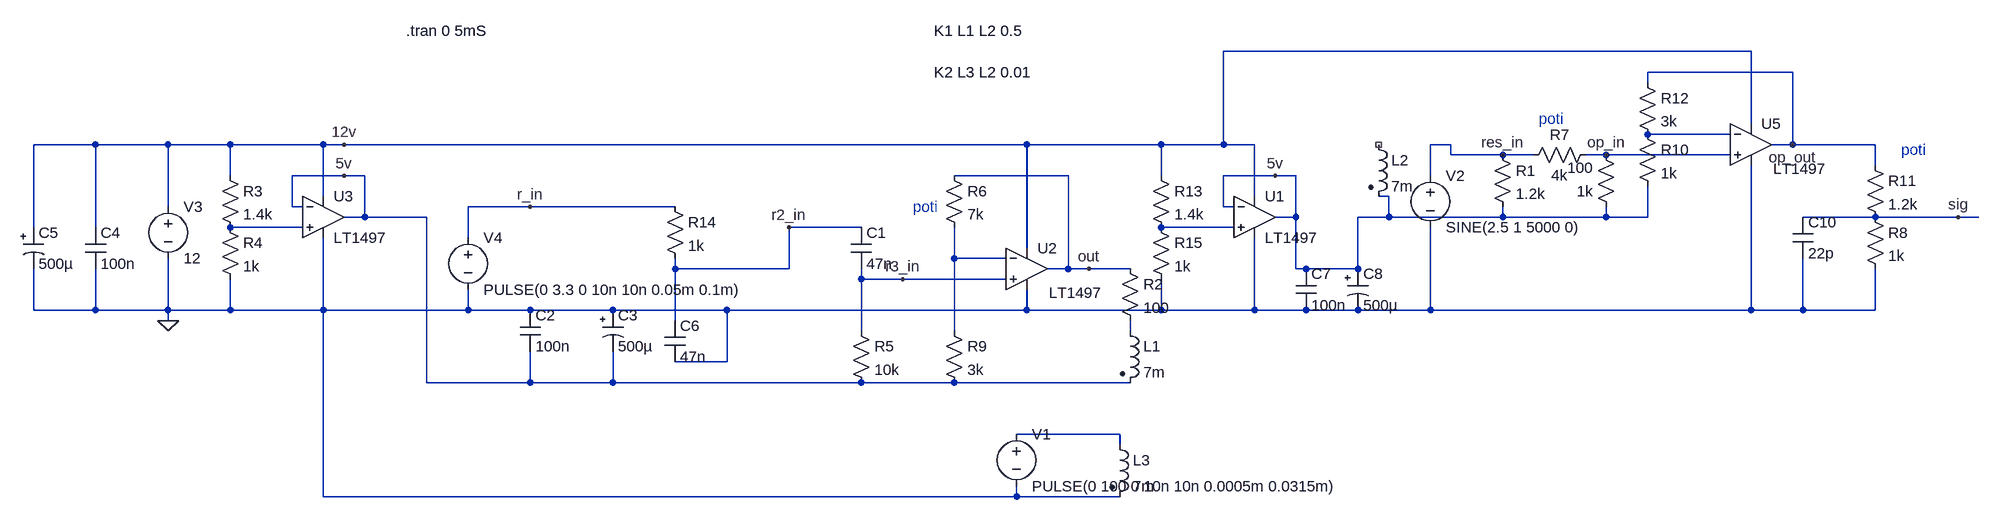
[diagram p0: schematic res2.4.asc]
res2.4.asc, the LTspice schematic file:
Version 4
SHEET 1 5176 960
WIRE 3744 -16 2928 -16
WIRE 3808 16 3584 16
WIRE 3584 32 3584 16
WIRE 3744 96 3744 -16
WIRE 3712 112 3584 112
WIRE 1184 128 1088 128
WIRE 1296 128 1184 128
WIRE 1392 128 1296 128
WIRE 1536 128 1392 128
WIRE 1568 128 1536 128
WIRE 2624 128 1568 128
WIRE 2832 128 2624 128
WIRE 2928 128 2928 -16
WIRE 2928 128 2832 128
WIRE 2976 128 2928 128
WIRE 3280 128 3248 128
WIRE 3808 128 3808 16
WIRE 3808 128 3776 128
WIRE 3936 128 3808 128
WIRE 3280 144 3280 128
WIRE 3360 144 3280 144
WIRE 3408 144 3360 144
WIRE 3520 144 3488 144
WIRE 3712 144 3520 144
WIRE 3936 160 3936 128
WIRE 1392 176 1392 128
WIRE 1568 176 1488 176
WIRE 1600 176 1568 176
WIRE 2688 176 2512 176
WIRE 2832 176 2832 128
WIRE 3008 176 2928 176
WIRE 3040 176 3008 176
WIRE 3248 176 3248 128
WIRE 1536 208 1536 128
WIRE 2976 208 2976 128
WIRE 3184 208 3168 208
WIRE 1296 224 1296 128
WIRE 1488 224 1488 176
WIRE 1504 224 1488 224
WIRE 1856 224 1760 224
WIRE 2080 224 1856 224
WIRE 2928 224 2928 176
WIRE 2944 224 2928 224
WIRE 1600 240 1600 176
WIRE 1600 240 1568 240
WIRE 1696 240 1600 240
WIRE 3040 240 3040 176
WIRE 3040 240 3008 240
WIRE 3184 240 3184 208
WIRE 3184 240 3136 240
WIRE 3360 240 3360 224
WIRE 3360 240 3184 240
WIRE 3520 240 3520 224
WIRE 3520 240 3360 240
WIRE 3584 240 3584 192
WIRE 3584 240 3520 240
WIRE 3936 240 3824 240
WIRE 4064 240 3936 240
WIRE 4096 240 4064 240
WIRE 1088 256 1088 128
WIRE 1184 256 1184 128
WIRE 1504 256 1392 256
WIRE 2368 256 2256 256
WIRE 2944 256 2832 256
WIRE 1760 272 1760 224
WIRE 2624 288 2624 128
WIRE 2512 304 2512 256
WIRE 2592 304 2512 304
WIRE 2080 320 2080 304
WIRE 2256 320 2256 256
WIRE 2256 320 2080 320
WIRE 2688 320 2688 176
WIRE 2688 320 2656 320
WIRE 2720 320 2688 320
WIRE 2784 320 2720 320
WIRE 3040 320 3040 240
WIRE 3056 320 3040 320
WIRE 3136 320 3136 240
WIRE 3136 320 3056 320
WIRE 2368 336 2368 320
WIRE 2432 336 2368 336
WIRE 2592 336 2432 336
WIRE 1088 384 1088 320
WIRE 1184 384 1184 320
WIRE 1184 384 1088 384
WIRE 1296 384 1296 304
WIRE 1296 384 1184 384
WIRE 1392 384 1392 336
WIRE 1392 384 1296 384
WIRE 1536 384 1536 272
WIRE 1536 384 1392 384
WIRE 1760 384 1760 352
WIRE 1760 384 1536 384
WIRE 1856 384 1760 384
WIRE 1984 384 1856 384
WIRE 2160 384 1984 384
WIRE 2624 384 2624 352
WIRE 2624 384 2160 384
WIRE 2832 384 2832 336
WIRE 2832 384 2624 384
WIRE 2976 384 2976 272
WIRE 2976 384 2832 384
WIRE 3056 384 2976 384
WIRE 3136 384 3056 384
WIRE 3248 384 3248 256
WIRE 3248 384 3136 384
WIRE 3744 384 3744 160
WIRE 3744 384 3248 384
WIRE 3824 384 3824 304
WIRE 3824 384 3744 384
WIRE 3936 384 3936 320
WIRE 3936 384 3824 384
WIRE 1296 400 1296 384
WIRE 2080 400 2080 320
WIRE 2368 416 2368 336
WIRE 2512 416 2512 304
WIRE 2784 416 2784 400
WIRE 2160 464 2160 384
WIRE 2160 464 2080 464
WIRE 1696 496 1696 240
WIRE 1856 496 1856 448
WIRE 1856 496 1696 496
WIRE 1984 496 1984 448
WIRE 1984 496 1856 496
WIRE 2368 496 1984 496
WIRE 2512 496 2368 496
WIRE 2784 496 2512 496
WIRE 2768 576 2608 576
WIRE 2768 592 2768 576
WIRE 1536 672 1536 384
WIRE 2608 672 2608 656
WIRE 2608 672 1536 672
WIRE 2768 672 2608 672
FLAG 1296 400 0
FLAG 1568 176 5v
FLAG 2720 320 out
FLAG 1856 224 r_in
FLAG 2256 256 r2_in
FLAG 2432 336 r3_in
FLAG 1568 128 12v
FLAG 3008 176 5v
FLAG 4064 240 sig
FLAG 3360 144 res_in
FLAG 3520 144 op_in
FLAG 3808 128 op_out
SYMBOL voltage 1296 208 R0
SYMATTR InstName V3
SYMATTR Value 12
SYMATTR SpiceLine Rser=1
SYMBOL res 1376 160 R0
SYMATTR InstName R3
SYMATTR Value 1.4k
SYMBOL res 1376 240 R0
SYMATTR InstName R4
SYMATTR Value 1k
SYMBOL ind2 2768 400 R0
SYMATTR InstName L1
SYMATTR Value 7m
SYMATTR Type ind
SYMATTR SpiceLine Rser=30
SYMBOL Opamps/LT1497 2624 256 R0
WINDOW 3 34 101 Left 2
SYMATTR InstName U2
SYMBOL ind2 3152 112 R0
SYMATTR InstName L2
SYMATTR Value 7m
SYMATTR SpiceLine Rser=70
SYMBOL res 2352 400 R0
SYMATTR InstName R5
SYMATTR Value 10k
SYMBOL cap 2352 256 R0
SYMATTR InstName C1
SYMATTR Value 47n
SYMBOL res 2496 160 R0
SYMATTR InstName R6
SYMATTR Value 7k
SYMBOL res 2496 400 R0
SYMATTR InstName R9
SYMATTR Value 3k
SYMBOL Opamps/LT1497 1536 176 R0
SYMATTR InstName U3
SYMBOL voltage 1760 256 R0
SYMATTR InstName V4
SYMATTR Value PULSE(0 3.3 0 10n 10n 0.05m 0.1m)
SYMATTR SpiceLine Rser=1
SYMBOL cap 2064 400 R0
SYMATTR InstName C6
SYMATTR Value 47n
SYMBOL res 2064 208 R0
SYMATTR InstName R14
SYMATTR Value 1k
SYMBOL cap 1840 384 R0
SYMATTR InstName C2
SYMATTR Value 100n
SYMBOL polcap 1968 384 R0
SYMATTR InstName C3
SYMATTR Value 500µ
SYMBOL cap 1168 256 R0
SYMATTR InstName C4
SYMATTR Value 100n
SYMBOL polcap 1072 256 R0
SYMATTR InstName C5
SYMATTR Value 500µ
SYMBOL ind2 2752 576 R0
SYMATTR InstName L3
SYMATTR Value 7m
SYMATTR Type ind
SYMATTR SpiceLine Rser=30
SYMBOL voltage 2608 560 R0
SYMATTR InstName V1
SYMATTR Value PULSE(0 100 0 10n 10n 0.0005m 0.0315m)
SYMATTR SpiceLine Rser=1
SYMBOL Opamps/LT1497 3744 64 R0
WINDOW 3 34 101 Left 2
SYMATTR InstName U5
SYMBOL res 3568 96 R0
SYMATTR InstName R10
SYMATTR Value 1k
SYMBOL res 3568 16 R0
SYMATTR InstName R12
SYMATTR Value 3k
SYMBOL res 2816 160 R0
SYMATTR InstName R13
SYMATTR Value 1.4k
SYMBOL res 2816 240 R0
SYMATTR InstName R15
SYMATTR Value 1k
SYMBOL Opamps/LT1497 2976 176 R0
SYMATTR InstName U1
SYMBOL cap 3040 320 R0
SYMATTR InstName C7
SYMATTR Value 100n
SYMBOL polcap 3120 320 R0
SYMATTR InstName C8
SYMATTR Value 500µ
SYMBOL res 3920 224 R0
SYMATTR InstName R8
SYMATTR Value 1k
SYMBOL res 3920 144 R0
SYMATTR InstName R11
SYMATTR Value 1.2k
SYMBOL cap 3808 240 R0
SYMATTR InstName C10
SYMATTR Value 22p
SYMBOL res 3344 128 R0
SYMATTR InstName R1
SYMATTR Value 1.2k
SYMBOL res 2768 304 R0
SYMATTR InstName R2
SYMATTR Value 100
SYMBOL voltage 3248 160 R0
SYMATTR InstName V2
SYMATTR Value SINE(2.5 1 5000 0)
SYMATTR SpiceLine Rser=1
SYMBOL res 3536 240 R180
WINDOW 0 36 76 Left 2
WINDOW 3 36 40 Left 2
SYMATTR InstName 100
SYMATTR Value 1k
SYMBOL res 3504 128 R90
WINDOW 0 0 56 VBottom 2
WINDOW 3 32 56 VTop 2
SYMATTR InstName R7
SYMATTR Value 4k
TEXT 1664 -48 Left 2 !.tran 0 5mS
TEXT 2480 -48 Left 2 !K1 L1 L2 0.5
TEXT 2480 16 Left 2 !K2 L3 L2 0.01
TEXT 3976 136 Left 2 ;poti
TEXT 3416 88 Left 2 ;poti
TEXT 2448 224 Left 2 ;poti

The netlist it stands for:
* res2.4.asc
V3 12v 0 12 Rser=1
R3 12v N002 1.4k
R4 N002 0 1k
L1 N005 5v 7m Rser=30
XU2 r3_in N004 12v 0 out LT1497  ; pins In+ In- V+ V- OUT
L2 NC_01 5v 7m Rser=70
R5 r3_in 5v 10k
C1 r2_in r3_in 47n
R6 out N004 7k
R9 N004 5v 3k
XU3 N002 5v 12v 0 5v LT1497  ; pins In+ In- V+ V- OUT
V4 r_in 0 PULSE(0 3.3 0 10n 10n 0.05m 0.1m) Rser=1
C6 r2_in 0 47n
R14 r_in r2_in 1k
C2 0 5v 100n
C3 0 5v 500µ
C4 12v 0 100n
C5 12v 0 500µ
L3 N006 0 7m Rser=30
V1 N006 0 PULSE(0 100 0 10n 10n 0.0005m 0.0315m) Rser=1
XU5 op_in N001 12v 0 op_out LT1497  ; pins In+ In- V+ V- OUT
R10 N001 5v 1k
R12 op_out N001 3k
R13 12v N003 1.4k
R15 N003 0 1k
XU1 N003 5v 12v 0 5v LT1497  ; pins In+ In- V+ V- OUT
C7 5v 0 100n
C8 5v 0 500µ
R8 sig 0 1k
R11 op_out sig 1.2k
C10 sig 0 22p
R1 res_in 5v 1.2k
R2 out N005 100
V2 res_in 0 SINE(2.5 1 5000 0) Rser=1
R§100 5v op_in 1k
R7 op_in res_in 4k
.tran 0 5mS
K1 L1 L2 0.5
K2 L3 L2 0.01
* poti
* poti
* poti
.backanno
.end